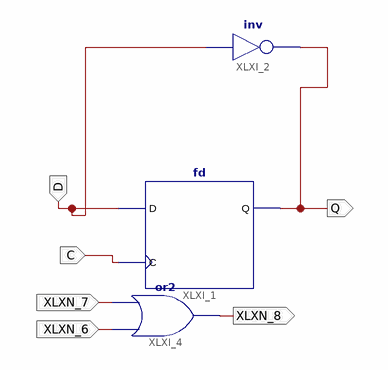
[diagram p0: schematic sheet 1]
// Xilinx ISE schematic test.sch (kintex7) as structural Verilog: 3 symbols, 6 ports
module test (
  input  D,
  input  C,
  input  XLXN_6,
  input  XLXN_7,
  output Q,
  output XLXN_8
);

  fd XLXI_1 (.C(C), .D(D), .Q(Q));
  not XLXI_2 (Q, D);
  or XLXI_4 (XLXN_8, XLXN_6, XLXN_7);
endmodule
